# EAGLE design Escorna_CPU_2_20 (EAGLE 6.5.0)
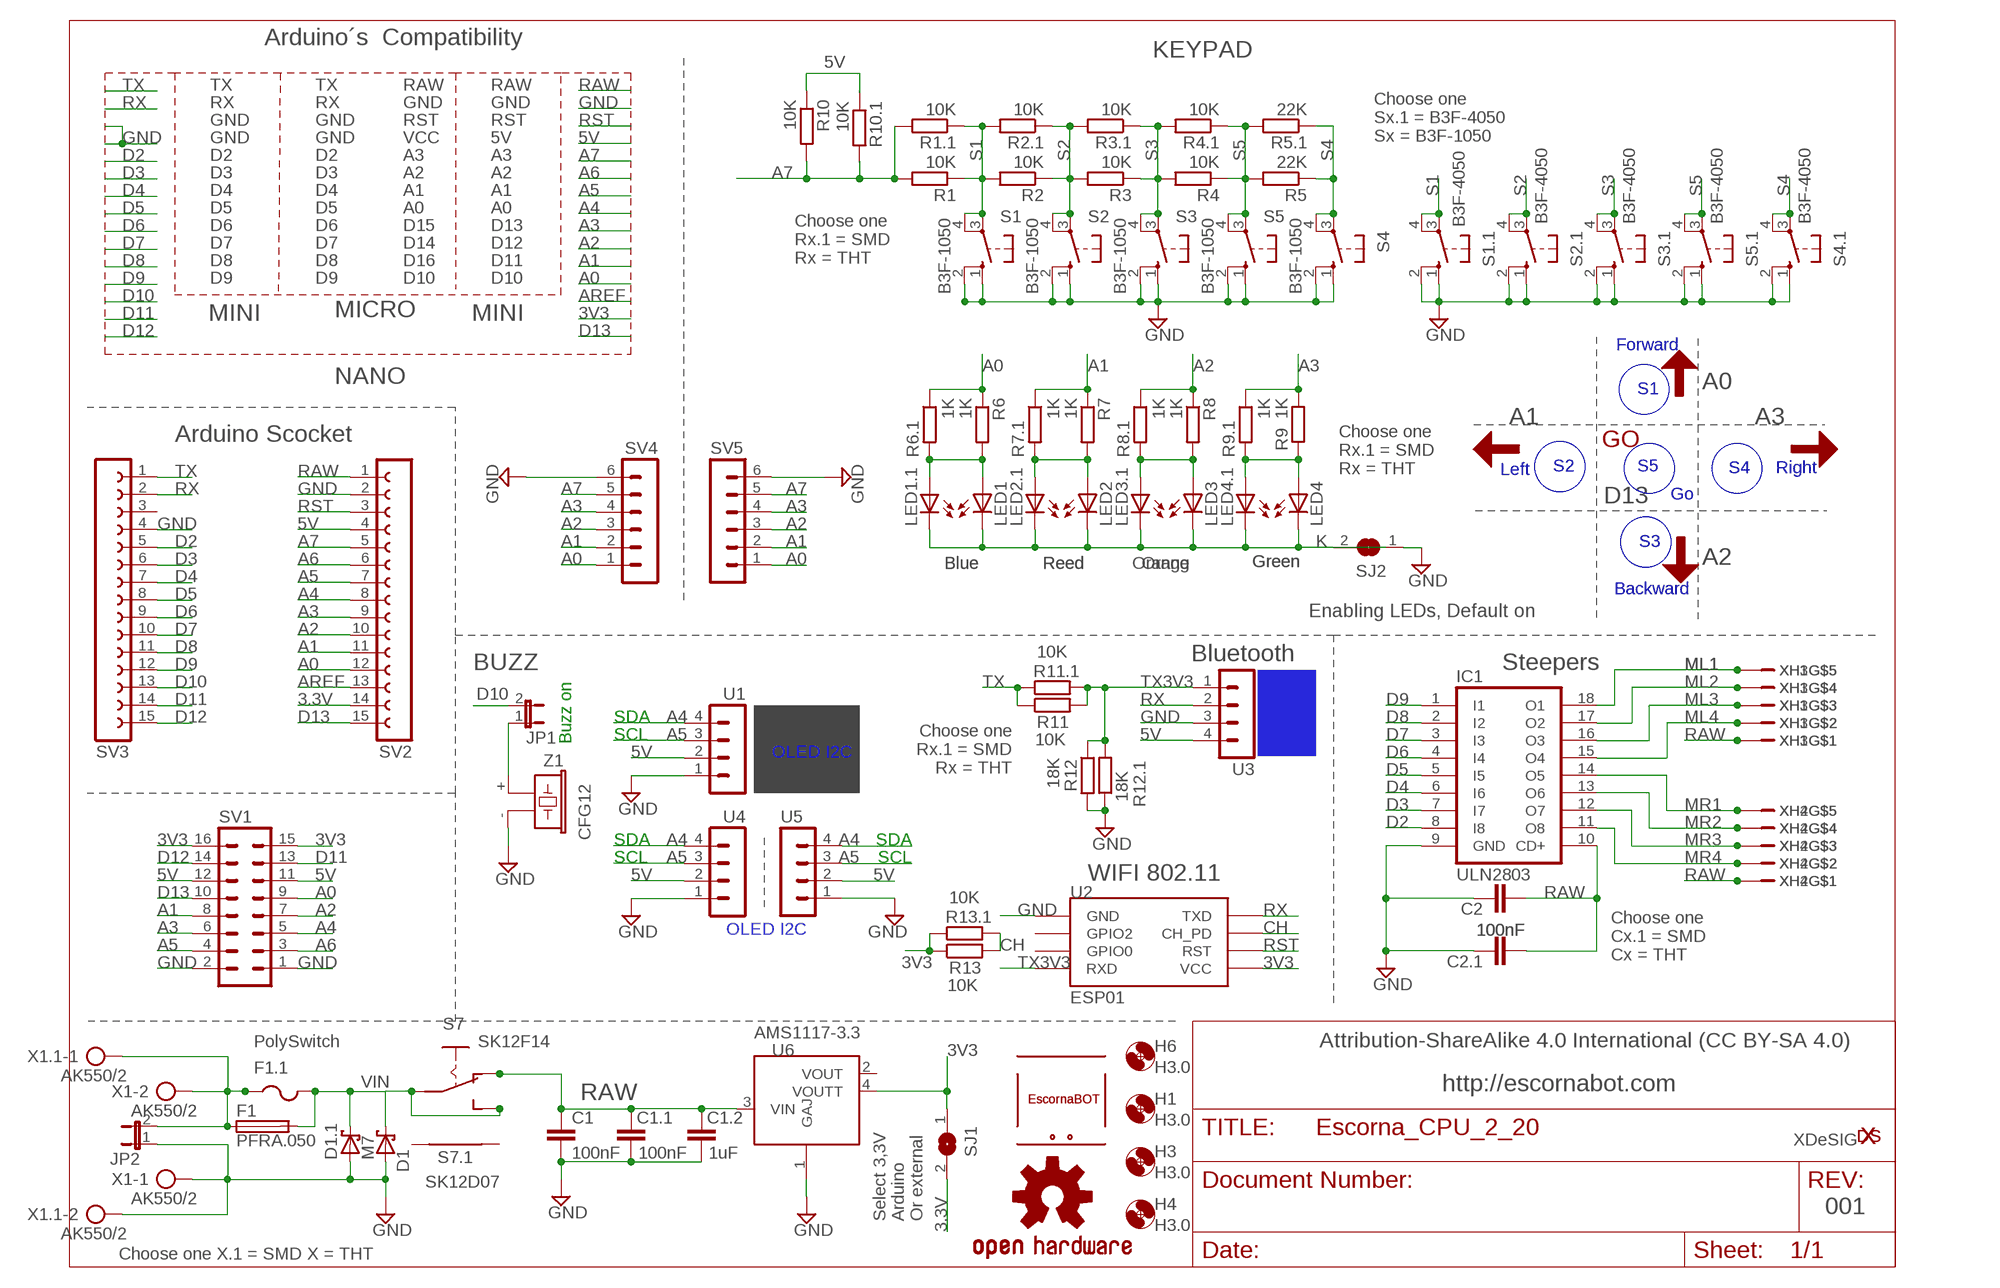
[diagram p0: schematic, sheet 1]

## Parts
C1  100nF  C-EU025-025X050  [C025-025X050]
C1.1  100nF  C-EUC0603K  [C0603K]
C1.2  1uF  C-EUC0603K  [C0603K]
C2  100nF  C-EU025-025X050  [C025-025X050]
C2.1  100nF  C-EUC0603K  [C0603K]
D1  1N5817  P4KEXX  [DO41-10]
D1.1  M7  SCHOTTKY-DIODESMA  [SMA]
ESC1  ESCORNABOT  [ESCORNA_PEQUE]
ESC2  ESCORNABOT  [ESCORNA_PEQUE]
F1  PFRA.050  FUSETE5  [TE5]
F1.1  PolySwitch  PTCFUSE-1206  [R1206]
H1  H3.0  MOUNT-HOLE3.0  [3,0]
H3  H3.0  MOUNT-HOLE3.0  [3,0]
H4  H3.0  MOUNT-HOLE3.0  [3,0]
H6  H3.0  MOUNT-HOLE3.0  [3,0]
IC1  ULN2803  ULN2803A  [DIL18]
JP1  JP1E  [1X02]
JP2  JP1E  [1X02]
LED1  Blue  LED3MM  [LED3MM]
LED1.1  Blue  LEDCHIPLED_0603  [CHIPLED_0603]
LED2  Reed  LED3MM  [LED3MM]
LED2.1  Reed  LEDCHIPLED_0603  [CHIPLED_0603]
LED3  Orange  LED3MM  [LED3MM]
LED3.1  Orang  LEDCHIPLED_0603  [CHIPLED_0603]
LED4  Green  LED3MM  [LED3MM]
LED4.1  Green  LEDCHIPLED_0603  [CHIPLED_0603]
LOGO2  OSHW-LOGOS  [OSHW-LOGO-S]
R1  10K  R-EU_0204/7  [0204/7]
R1.1  10K  R-EU_R0603  [R0603]
R2  10K  R-EU_0204/7  [0204/7]
R2.1  10K  R-EU_R0603  [R0603]
R3  10K  R-EU_0204/7  [0204/7]
R3.1  10K  R-EU_R0603  [R0603]
R4  10K  R-EU_0204/7  [0204/7]
R4.1  10K  R-EU_R0603  [R0603]
R5  22K  R-EU_0204/7  [0204/7]
R5.1  22K  R-EU_R0603  [R0603]
R6  1K  R-EU_0204/7  [0204/7]
R6.1  1K  R-EU_R0603  [R0603]
R7  1K  R-EU_0204/7  [0204/7]
R7.1  1K  R-EU_R0603  [R0603]
R8  1K  R-EU_0204/7  [0204/7]
R8.1  1K  R-EU_R0603  [R0603]
R9  1K  R-EU_0204/7  [0204/7]
R9.1  1K  R-EU_R0603  [R0603]
R10  10K  R-EU_0204/7  [0204/7]
R10.1  10K  R-EU_R0603  [R0603]
R11  10K  R-EU_0204/7  [0204/7]
R11.1  10K  R-EU_R0603  [R0603]
R12  18K  R-EU_0204/7  [0204/7]
R12.1  18K  R-EU_R0603  [R0603]
R13  10K  R-EU_0204/7  [0204/7]
R13.1  10K  R-EU_R0603  [R0603]
S1  B3F-1050  10-XX  [B3F-10XX]
S1.1  B3F-4050  40-XX  [B3F-40XX]
S2  B3F-1050  10-XX  [B3F-10XX]
S2.1  B3F-4050  40-XX  [B3F-40XX]
S3  B3F-1050  10-XX  [B3F-10XX]
S3.1  B3F-4050  40-XX  [B3F-40XX]
S4  B3F-1050  10-XX  [B3F-10XX]
S4.1  B3F-4050  40-XX  [B3F-40XX]
S5  B3F-1050  10-XX  [B3F-10XX]
S5.1  B3F-4050  40-XX  [B3F-40XX]
S7  SK12F14  ESCORNA_SK12F14F  [ESCORNA_SK-12F14-G]
S7.1  SK12D07  ESCORNA_SK12F14D  [ESCORNA_SK-12D07]
SJ1  SJ  [SJ]
SJ2  SJ  [SJ]
SV1  MA08-2  [MA08-2]
SV2  1x15 SOCKET STRIP  CON-LSTA_FE15-1  [CON-LSTA_FE15]
SV3  1x15 SOCKET STRIP  CON-LSTA_FE15-1  [CON-LSTA_FE15]
SV4  MA06-1  [MA06-1]
SV5  MA06-1  [MA06-1]
U1  MA04-1  [MA04-1]
U2  ESP01  [ESP01]
U3  MA04-1  [MA04-1]
U4  MA04-1  [MA04-1]
U5  MA04-1  [MA04-1]
U6  AMS1117-3.3  ASM1117-3.3  [SOT223]
U$1  FRECHA  [FRECHA]
U$2  GO  [VALE]
U$3  FRECHA  [FRECHA]
U$6  FRECHA  [FRECHA]
U$11  FRECHA  [FRECHA]
U$13  XDESIG_XDESIG21  [XDESIG_XDESIG]
X1  AK550/2  [AK550/2]
X1.1  AK550/2  [AK550/2]
XDS1  XDESIG  [XDESIG_CU_2]
XH1  B5B-XH-A  [B5B-XH-A]
XH2  B5B-XH-A  [B5B-XH-A]
XH3  B5B-XH-A  [B5B-XH-A]
XH4  B5B-XH-A  [B5B-XH-A]
Z1  CFG12  F/CM12P  [F/CM12P]

## Nets
3.3V: SJ1.2 SV2.14
3V3: R13.1 R13.1.1 SJ1.1 SV1.15 SV1.16 U2.VCC U6.4(VOUTT)
5V: R10.1 R10.1.1 SV1.11 SV1.12 SV2.4 U1.2 U3.4 U4.2 U5.2
A0: R6.1 R6.1.1 SV1.9 SV2.12 SV4.1 SV5.1
A1: R7.1 R7.1.1 SV1.8 SV2.11 SV4.2 SV5.2
A2: R8.1 R8.1.1 SV1.7 SV2.10 SV4.3 SV5.3
A3: R9.1.1 R9.2 SV1.6 SV2.9 SV4.4 SV5.4
A4: SV1.5 SV2.8 U1.4 U4.4 U5.4
A5: SV1.4 SV2.7 U1.3 U4.3 U5.3
A6: SV1.3 SV2.6
A7: R1.1.2 R1.2 R10.1.2 R10.2 SV2.5 SV4.5 SV5.5
AREF: SV2.13
CH: R13.1.2 R13.2 U2.CH_PD
D2: IC1.8(I8) SV3.5
D3: IC1.7(I7) SV3.6
D4: IC1.6(I6) SV3.7
D5: IC1.5(I5) SV3.8
D6: IC1.4(I4) SV3.9
D7: IC1.3(I3) SV3.10
D8: IC1.2(I2) SV3.11
D9: IC1.1(I1) SV3.12
D10: JP1.2 SV3.13
D11: SV1.13 SV3.14
D12: SV1.14 SV3.15
D13: SV1.10 SV2.15
GND: C1.1.1 C1.2 C1.2.1 C2.1 C2.1.1 D1.1.A D1.A IC1.9(GND) JP2.1 R12.1.1 R12.2 S1.1(S) S1.1.1(S) S1.1.2(S1) S1.2(S1) S2.1(S) S2.1.1(S) S2.1.2(S1) S2.2(S1) S3.1(S) S3.1.1(S) S3.1.2(S1) S3.2(S1) S4.1(S) S4.1.1(S) S4.1.2(S1) S4.2(S1) S5.1(S) S5.1.1(S) S5.1.2(S1) S5.2(S1) SJ2.1 SV1.1 SV1.2 SV2.2 SV3.4 SV4.6 SV5.6 U1.1 U2.GND U3.3 U4.1 U5.1 U6.1(GAJ) X1.1 X1.1.2 Z1.-
K: LED1.1.C LED1.K(C) LED2.1.C LED2.K(C) LED3.1.C LED3.K(C) LED4.1.C LED4.K(C) SJ2.2
ML1: IC1.18(O1) XH1.P$5 XH3.P$5
ML2: IC1.17(O2) XH1.P$4 XH3.P$4
ML3: IC1.16(O3) XH1.P$3 XH3.P$3
ML4: IC1.15(O4) XH1.P$2 XH3.P$2
MR1: IC1.14(O5) XH2.P$5 XH4.P$5
MR2: IC1.13(O6) XH2.P$4 XH4.P$4
MR3: IC1.12(O7) XH2.P$3 XH4.P$3
MR4: IC1.11(O8) XH2.P$2 XH4.P$2
N$2: JP1.1 Z1.+
N$3: F1.1 F1.1.1 JP2.2 X1.1.1 X1.2
N$4: LED2.1.A LED2.A R7.1.2 R7.2
N$5: LED1.1.A LED1.A R6.1.2 R6.2
N$6: LED3.1.A LED3.A R8.1.2 R8.2
N$8: LED4.1.A LED4.A R9.1 R9.1.2
N$10: S7.1.P$4 S7.P$4
N$11: S7.1.P$5 S7.P$5
RAW: C1.1 C1.1.2 C1.2.2 C2.1.2 C2.2 IC1.10(CD+) S7.1.P$2(O) S7.P$2(O) SV2.1 U6.3(VIN) XH1.P$1 XH2.P$1 XH3.P$1 XH4.P$1
RST: SV2.3 U2.RST
RX: SV3.2 U2.TX(TXD) U3.2
S1: R1.1 R1.1.1 R2.1.2 R2.2 S1.1.3(P) S1.1.4(P1) S1.3(P) S1.4(P1)
S2: R2.1 R2.1.1 R3.1.2 R3.2 S2.1.3(P) S2.1.4(P1) S2.3(P) S2.4(P1)
S3: R3.1 R3.1.1 R4.1.2 R4.2 S3.1.3(P) S3.1.4(P1) S3.3(P) S3.4(P1)
S4: R5.1 R5.1.1 S4.1.3(P) S4.1.4(P1) S4.3(P) S4.4(P1)
S5: R4.1 R4.1.1 R5.1.2 R5.2 S5.1.3(P) S5.1.4(P1) S5.3(P) S5.4(P1)
TX: R11.1 R11.1.1 SV3.1
TX3V3: R11.1.2 R11.2 R12.1 R12.1.2 U2.RX(RXD) U3.1
VIN: D1.1.C D1.C F1.1.2 F1.2 S7.1.P$1(P) S7.1.P$3(S) S7.P$1(P) S7.P$3(S)
Unconnected: SV3.3 U2.GPIO0 U2.GPIO2 U6.2(VOUT)

## Notes on the sheet
- Arduino´s  Compatibility
- KEYPAD
- TX | TX | RAW | RAW
- RX | RX | GND | GND
- GND | GND | RST | RST
- Choose one
  Sx.1 = B3F-4050
  Sx = B3F-1050
- GND | GND | VCC | 5V
- D2 | D2 | A3 | A3
- D3 | D3 | A2 | A2
- D4 | D4 | A1 | A1
- D5 | D5 | A0 | A0
- D6 | D6 | D15 | D13
- D7 | D7 | D14 | D12
- D8 | D8 | D16 | D11
- Choose one
  Rx.1 = SMD
  Rx = THT
- D9 | D9 | D10 | D10
- MINI | MINI
- MICRO
- Forward
- NANO | A0
- S1
- A1 | A3
- Arduino Scocket
- Left | S2 | S5 | S4 | Right
- Choose one
  Rx.1 = SMD
  Rx = THT
- D13 | Go
- S3
- A2
- Backward
- Enabling LEDs, Default on
- Bluetooth
- BUZZ | Steepers
- RXD
- TXD
- SDA
- Choose one
  Rx.1 = SMD
  Rx = THT
- GND
- Buzz on | SCL | VCC
- OLED I2C
- SDA | SDA
- SCL | SCL
- WIFI 802.11
- OLED I2C
- Choose one
  Cx.1 = SMD
  Cx = THT
- Attribution-ShareAlike 4.0 International (CC BY-SA 4.0)
- http://escornabot.com
- XDeSIG
- 001
- Select 3,3V
  Arduino
  Or external
- Choose one X.1 = SMD X = THT

## Library data of the parts
C1 C1.1 C1.2 C2 C2.1 = rcl:C-EU: CAPACITOR, European symbol
D1 = diode:P4KEXX: DIODE transient-voltage suppressor
D1.1 = diode:SCHOTTKY-DIODE: Schottky Diode
ESC1 ESC2 = escorna:ESCORNABOT
F1 = fuse:FUSE: Fuse; OC_FARNELL: unknown; OC_NEWARK: unknown
F1.1 = adafruit:PTCFUSE: PTC fuses, resettable thermistors
H1 H3 H4 H6 = holes:MOUNT-HOLE: MOUNTING HOLE with drill center marker
IC1 = uln-udn:ULN2803A: DRIVER ARRAY
JP1 JP2 = SparkFunEagle-6-6-07:JP1E: Jumper Basic 0.1" spaced jumper. Use with breakaway headers.
LED1 LED1.1 LED2 LED2.1 LED3 LED3.1 LED4 LED4.1 = led:LED: LED OSRAM: - CHIPLED LG R971, LG N971, LY N971, LG Q971, LY Q971, LO R971, LY R971 LH N974, LH R974 LS Q976, LO Q976, LY Q976 LO Q996 - Hyper CHIPLED LW Q18S LB Q993, LB Q99A, LB R99A - SideLED LS A670, LO A670, LY A670, LG A670, LP A670 LB A673, LV A673, LT A673, LW A673 LH A674 LY A675 LS A676, LA A676, LO A676, LY A676, LW A676 LS A679, LY A679, LG A679 - Hyper Micro SIDELED® LS Y876, LA Y876, LO Y876, LY Y876 LT Y87S - SmartLED LW L88C, LW L88S LB L89C, LB L89S, LG L890 LS L89K, LO L89K, LY L89K LS L896, LA L896, LO L896, LY L896 - TOPLED LS T670, LO T670, LY T670, LG T670, LP T670 LSG T670, LSP T670, LSY T670, LOP T670, LYG T670 LG T671, LOG T671, LSG T671 LB T673, LV T673, LT T673, LW T673 LH T674 LS T676, LA T676, LO T676, LY T676, LB T676, LH T676, LSB T676, LW T676 LB T67C, LV T67C, LT T67C, LS T67K, LO T67K, LY T67K, LW E67C LS E67B, LA E67B, LO E67B, LY E67B, LB E67C, LV E67C, LT E67C LW T67C LS T679, LY T679, LG T679 LS T770, LO T770, LY T770, LG T770, LP T770 LB T773, LV T773, LT T773, LW T773 LH T774 LS E675, LA E675, LY E675, LS T675 LS T776, LA T776, LO T776, LY T776, LB T776 LHGB T686 LT T68C, LB T68C - Hyper Mini TOPLED® LB M676 - Mini TOPLED Santana® LG M470 LS M47K, LO M47K, LY M47K Source: http://www.osram.convergy.de - LUMILED® LXK2-PW12-R00, LXK2-PW12-S00, LXK2-PW14-U00, LXK2-PW14-V00 LXK2-PM12-R00, LXK2-PM12-S00, LXK2-PM14-U00 LXK2-PE12-Q00, LXK2-PE12-R00, LXK2-PE12-S00, LXK2-PE14-T00, LXK2-PE14-U00 LXK2-PB12-K00, LXK2-PB12-L00, LXK2-PB12-M00, LXK2-PB14-N00, LXK2-PB14-P00, LXK2-PB14-Q00 LXK2-PR12-L00, LXK2-PR12-M00, LXK2-PR14-Q00, LXK2-PR14-R00 LXK2-PD12-Q00, LXK2-PD12-R00, LXK2-PD12-S00 LXK2-PH12-R00, LXK2-PH12-S00 LXK2-PL12-P00, LXK2-PL12-Q00, LXK2-PL12-R00 Source: www.luxeon.com
LOGO2 = SparkFun-Aesthetics:OSHW-LOGO: Open Source Hardware Logo This logo indicates the piece of hardware it is found on incorporates a OSHW license and/or adheres to the definition of open source hardware found here: http://freedomdefined.org/OSHW
R1 R1.1 R2 R2.1 R3 R3.1 R4 R4.1 R5 R5.1 R6 R6.1 R7 R7.1 R8 R8.1 R9 R9.1 R10 R10.1 R11 R11.1 R12 R12.1 R13 R13.1 = rcl:R-EU_: RESISTOR, European symbol
S1-S5 = switch-omron:10-XX: OMRON SWITCH; MPN: B3F-1000; OC_FARNELL: 176432; OC_NEWARK: 36M3542
S1.1 S2.1 S3.1 S4.1 S5.1 = switch-omron:40-XX: OMRON SWITCH; MF: OMRON COMPONENTS USA; MPN: B3F-4000; OC_FARNELL: 176434; OC_NEWARK: 36K3105
S7 S7.1 = escorna_ELIB:ESCORNA_SK12F14
SJ1 SJ2 = jumper:SJ: SMD solder JUMPER
SV1 = con-lstb:MA08-2: PIN HEADER; OC_FARNELL: unknown; OC_NEWARK: unknown
SV2 SV3 = escorna_LBREscorna_CPU_2_10:CON-LSTA_FE15-1: FEMALE HEADER; OC_FARNELL: unknown; OC_NEWARK: unknown
SV4 SV5 = con-lstb:MA06-1: PIN HEADER; OC_FARNELL: unknown; OC_NEWARK: unknown
U1 U3-U5 = con-lstb:MA04-1: PIN HEADER; OC_FARNELL: unknown; OC_NEWARK: unknown
U2 = esp8266modules:ESP01: ESP8266 Wifi module 01
U6 = Itead_IC_110429:ASM1117-3.3: ICP006
U$1 U$3 U$6 U$11 = escorna:FRECHA
U$2 = escorna:GO
U$13 = Escorna_CPU_2_01:XDESIG_XDESIG
X1 X1.1 = con-ptr500:AK550/2: CONNECTOR; OC_FARNELL: unknown; OC_NEWARK: unknown
XDS1 = xdesig:XDESIG
XH1-XH4 = con-jst:B5B-XH-A
Z1 = buzzer:F/CM12P: BUZZER Source: Buerklin; OC_FARNELL: unknown; OC_NEWARK: unknown

## Net classes
0 default: width 0.254 mm, drill 0.61 mm, clearance 0.254 mm
1 power: width 0.254 mm, drill 0.61 mm, clearance 0.254 mm

## Board
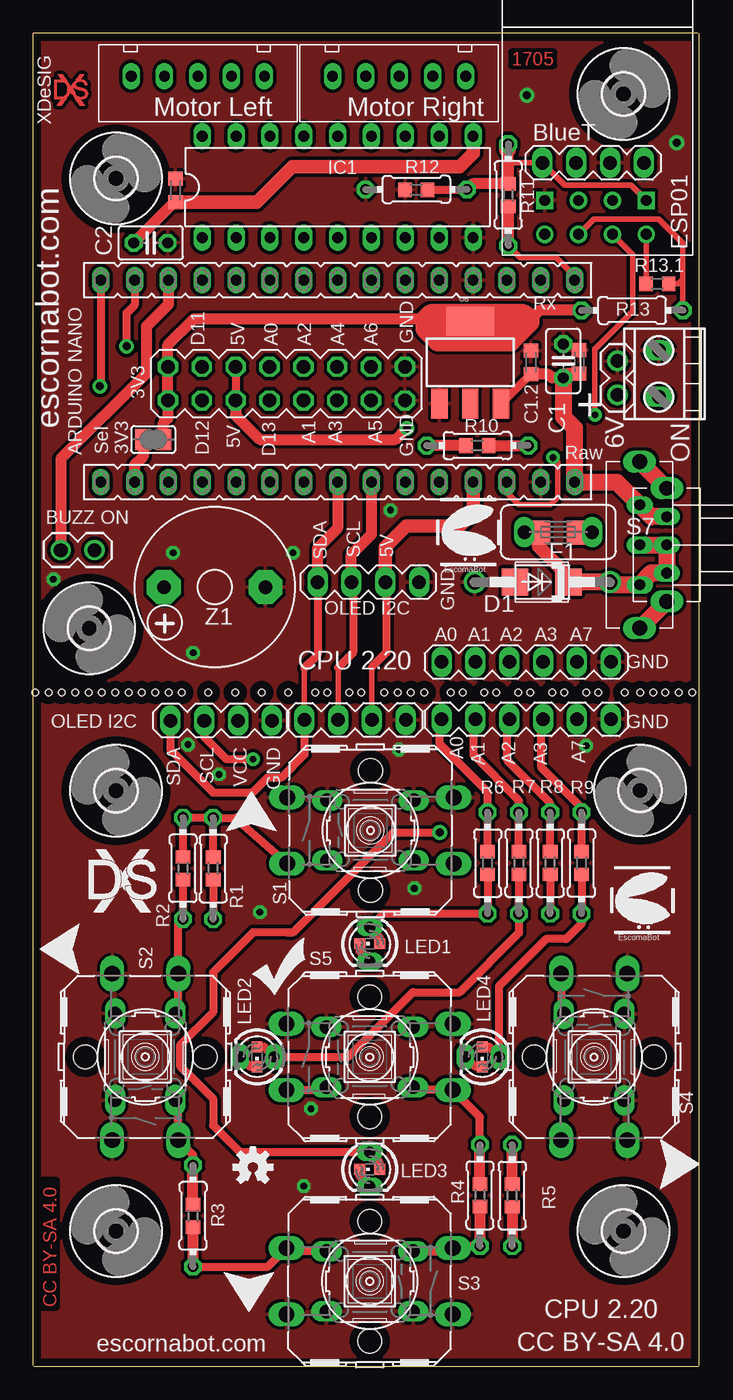
[diagram p1: board, top side]
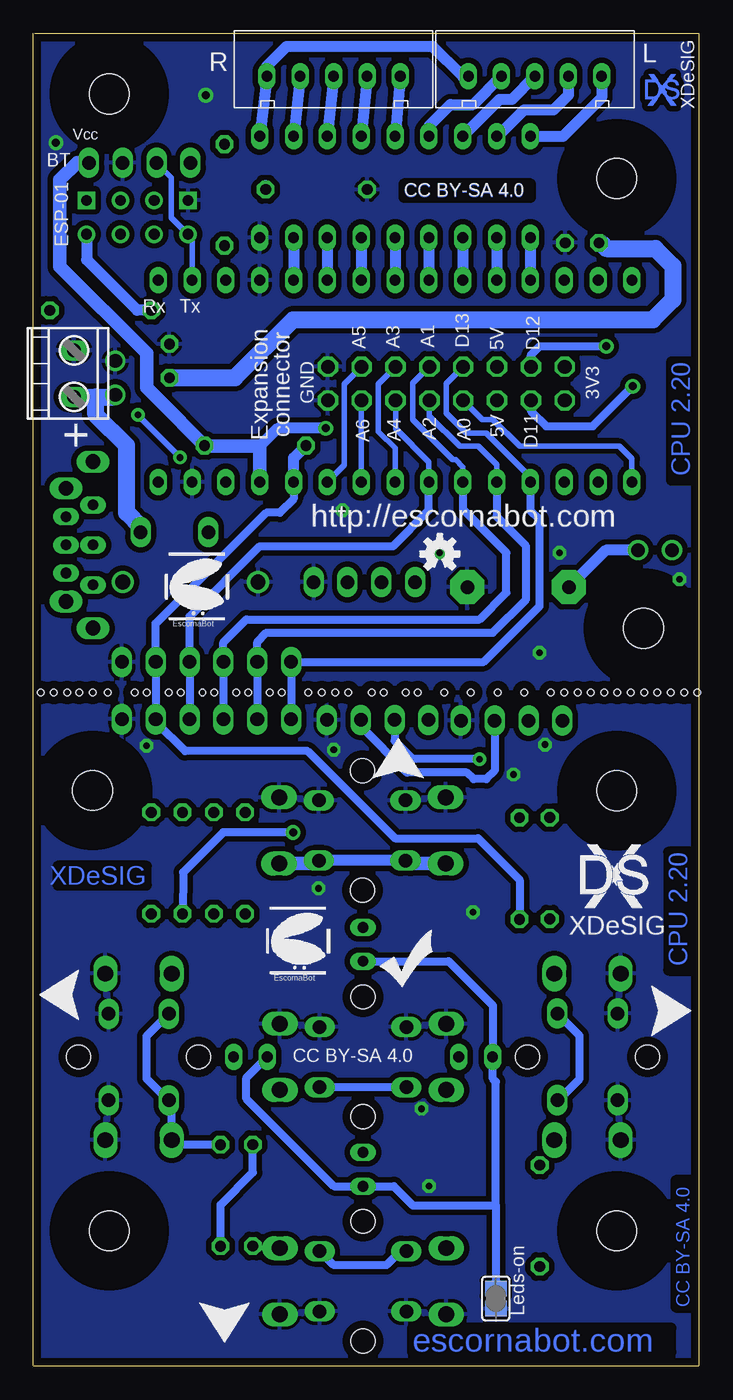
[diagram p2: board, bottom side, seen from below]

Size 50 x 100.09 mm. Coordinates in mm from the lower left corner, seen from the top.
Outline: 49.89,100.09 0,100.09
Outline: 0.05,0 49.95,0
Outline: 0,0.08 0,100.08
Outline: 50,0.08 50,100.08
Copper layers (1*16): Top 0.035mm / dielectric 1.5mm / Bottom 0.035mm
Design rules "default": minimum track width 10mil, minimum drill 22mil, track to track 10mil, track to pad 10mil, pad to pad 8mil, via to via 12mil, smd to smd 8mil, copper to edge 24mil, drill to drill 12mil, minimum pad ring 10mil, minimum via ring 10mil, stop-mask expansion 2mil, vias tented up to drill 30mil, thermal gap 10mil
Holes 0.5 mm at 31.35,50.58 32.25,50.58 33.85,50.58 34.75,50.58 23.7,50.58 24.6,50.58 21.15,50.58 22.05,50.58 36.4,50.58 37.3,50.58 38.95,50.58 39.85,50.58 41.5,50.58 42.4,50.58 44.4,50.58 46.55,50.58 47.45,50.58 49.45,50.58 19.15,50.58 17.15,50.58 15.15,50.58 13.15,50.58 10.15,50.58 9.15,50.58 8.15,50.58 7.15,50.58 6.15,50.58 5.15,50.58 4.15,50.58 3.15,50.58 2.15,50.58 1.15,50.58 28.35,50.58 29.35,50.58 27.35,50.58 26.35,50.58 48.45,50.58 11.15,50.58 45.55,50.58 0.15,50.58

### Footprints (pad centres in the part's own frame; a part is rotated, then mirrored left to right if it is on the bottom)
C025-025X050 = drill 0.813 octagon: 1 -1.27,0; 2 1.27,0
C0603K = smd 1.05 x 1.08: 1 -0.875,0; 2 0.875,0
DO41-10 = drill 1.118: A 5.08,0; C -5.08,0
SMA = smd 2 x 2: A 2,0; C -2,0
TE5 = drill 1.016 long: 1 -2.54,0; 2 2.54,0
R1206 = smd 1.6 x 1.803: 1 -1.422,0; 2 1.422,0
3,0 = hole 3: 0,0
DIL18 = drill 0.813 long: 1 -10.16,-3.81; 2 -7.62,-3.81; 3 -5.08,-3.81; 4 -2.54,-3.81; 5 0,-3.81; 6 2.54,-3.81; 7 5.08,-3.81; 8 7.62,-3.81; 9 10.16,-3.81; 10 10.16,3.81; 11 7.62,3.81; 12 5.08,3.81; 13 2.54,3.81; 14 0,3.81; 15 -2.54,3.81; 16 -5.08,3.81; 17 -7.62,3.81; 18 -10.16,3.81
1X02 = drill 1.016: 1 0,0; 2 2.54,0
LED3MM = drill 0.813 pad 1.016 long: A -1.27,0; K 1.27,0
CHIPLED_0603 = smd 0.8 x 0.8: A 0,-0.75; C 0,0.75
0204/7 = drill 0.813 octagon: 1 -3.81,0; 2 3.81,0
R0603 = smd 1 x 1.1: 1 -0.85,0; 2 0.85,0
B3F-10XX = drill 1.016 long: 1 -3.251,2.261; 2 3.251,2.261; 3 -3.251,-2.261; 4 3.251,-2.261
B3F-40XX = drill 1.194 long: 1 -6.248,2.489; 2 6.248,2.489; 3 -6.248,-2.489; 4 6.248,-2.489 | hole 1.803: 0,-4.496; 0,4.496
ESCORNA_SK-12F14-G = drill 0.8 long: P$1 0,0; P$2 3,0; P$3 -3,0 | drill 1.1 long: P$4 -6.25,0; P$5 6.25,0
ESCORNA_SK-12D07 = drill 0.8 long: P$1 0,0; P$2 2.115,0; P$3 -2.115,0 | drill 1.1 pad 1.27 long: P$4 -4.25,0; P$5 4.25,0
SJ = smd 1.168 x 1.6: 1 -0.762,0; 2 0.762,0
MA08-2 = drill 1.016 octagon: 1 -8.89,-1.27; 2 -8.89,1.27; 3 -6.35,-1.27; 4 -6.35,1.27; 5 -3.81,-1.27; 6 -3.81,1.27; 7 -1.27,-1.27; 8 -1.27,1.27; 9 1.27,-1.27; 10 1.27,1.27; 11 3.81,-1.27; 12 3.81,1.27; 13 6.35,-1.27; 14 6.35,1.27; 15 8.89,-1.27; 16 8.89,1.27
CON-LSTA_FE15 = drill 0.813 long: 1 -17.78,0; 2 -15.24,0; 3 -12.7,0; 4 -10.16,0; 5 -7.62,0; 6 -5.08,0; 7 -2.54,0; 8 0,0; 9 2.54,0; 10 5.08,0; 11 7.62,0; 12 10.16,0; 13 12.7,0; 14 15.24,0; 15 17.78,0
MA06-1 = drill 1.016 long: 1 -6.35,0; 2 -3.81,0; 3 -1.27,0; 4 1.27,0; 5 3.81,0; 6 6.35,0
MA04-1 = drill 1.016 long: 1 -3.81,0; 2 -1.27,0; 3 1.27,0; 4 3.81,0
ESP01 = drill 0.8: CH_PD -1.285,-8.178; GPIO0 1.255,-5.638; GPIO2 -1.285,-5.638; RST 1.255,-8.178; TX -3.825,-8.178; VCC 3.795,-8.178 | drill 0.8 square: GND -3.825,-5.638; RX 3.795,-5.638
SOT223 = smd 1.219 x 2.235: 1 -2.311,-3.099; 2 0,-3.099; 3 2.311,-3.099 | smd 3.6 x 2.2: 4 0,3.099
AK550/2 = drill 1 pad 1.5 long: 1 -1.75,0; 2 1.75,0
B5B-XH-A = drill 0.8 long: P$1 -5.17,-0.19; P$2 -2.69,-0.175; P$3 -0.175,-0.175; P$4 2.34,-0.175; P$5 4.83,-0.175
F/CM12P = drill 1.016 pad 2.54 octagon: + 3.81,0; - -3.81,0

### Placement (x,y rotation side)
C1  39.78,75.48 90 top
C1.1  40.97,75.42 270 top
C1.2  37.35,75.38 270 top
C2  8.81,84.35 180 top
C2.1  10.67,88.29 270 top
D1  38.21,58.88 180 top
D1.1  38.16,58.88 180 top
ESC  ESCORNABOT  [ESCORNA_PEQUE]  32.6,29.36 0 bottom
ESC1  40.2,55.96 0 bottom
ESC2  30.2,60.03 0 top
F1  39.4,62.63 180 top
F1.1  39.41,62.61 180 top
H1  44.3,10.16 90 top
H2  MOUNT-HOLE3.0  [3,0]  6.2,10.16 90 top
H3  44.3,95.53 0 top
H4  6.2,89.18 0 top
H5  MOUNT-HOLE3.0  [3,0]  6.2,43.21 90 top
H6  45.55,43.23 0 top
H7  MOUNT-HOLE3.0  [3,0]  4.2,55.41 90 top
IC1  22.84,88.54 0 top
JP1  4.6,61.28 180 top
JP2  43.85,75.48 270 top
LED1  25.25,31.68 270 top
LED1.1  25.25,31.73 90 top
LED2  16.8,23.23 180 top
LED2.1  16.8,23.23 180 top
LED3  25.25,14.78 270 top
LED3.1  25.25,14.78 90 top
LED4  33.7,23.23 180 top
LED4.1  33.7,23.23 180 top
LOGO1  OSHW-LOGOS  [OSHW-LOGO-S]  16.48,14.94 0 top
LOGO2  19.48,60.99 0 bottom
R1  13.5,37.37 270 top
R1.1  13.5,37.37 270 top
R2  11.24,37.39 90 top
R2.1  11.24,37.39 90 top
R3  11.99,11.29 90 top
R3.1  11.99,11.29 90 top
R4  33.52,12.83 270 top
R4.1  33.52,12.83 270 top
R5  35.95,12.82 270 top
R5.1  35.95,12.82 270 top
R6  34.1,37.78 270 top
R6.1  34.1,37.78 270 top
R7  36.45,37.78 270 top
R7.1  36.45,37.78 270 top
R8  38.8,37.78 270 top
R8.1  38.8,37.78 270 top
R9  41.15,37.78 90 top
R9.1  41.15,37.78 270 top
R10  33.34,69.13 180 top
R10.1  33.34,69.13 180 top
R11  35.65,87.95 90 top
R11.1  35.65,87.93 90 top
R12  28.75,88.36 180 top
R12.1  28.75,88.33 0 top
R13  44.95,79.28 0 top
R13.1  46.85,81.28 0 top
S1  25.31,40.23 0 top
S1.1  25.3,40.23 0 top
S2  8.41,23.23 90 top
S2.1  8.4,23.23 90 top
S3  25.25,6.38 180 top
S3.1  25.25,6.38 180 top
S4  42.09,23.21 270 top
S4.1  42.1,23.23 270 top
S5  25.25,23.21 0 top
S5.1  25.25,23.23 0 top
S7  45.52,61.67 90 top
S7.1  47.55,61.67 90 top
SJ1  9,69.58 180 top
SJ2  15.28,5.08 90 bottom
SV1  19,73.78 180 top
SV2  22.84,66.38 180 top
SV3  22.84,81.56 180 top
SV4  37,52.88 0 top
SV5  37,48.58 0 top
U1  25.15,58.88 180 top
U2  42.21,93.18 0 top
U3  42.02,90.36 0 top
U4  24.15,48.53 180 top
U5  14.1,48.48 180 top
U6  32.8,75.38 0 top
U$1  46.54,29.81 180 bottom
U$2  24.03,28.43 0 bottom
U$3  3.64,24.76 0 bottom
U$4  FRECHA  [FRECHA]  14.26,7.09 270 top
U$5  ESCORNABOT  [ESCORNA_PEQUE]  43.25,32.4 0 top
U$6  37.57,4.79 270 bottom
U$7  FRECHA  [FRECHA]  47.01,13.25 0 top
U$8  FRECHA  [FRECHA]  18.29,40.16 90 top
U$9  FRECHA  [FRECHA]  3.49,33.25 180 top
U$10  GO  [VALE]  16.4,27.85 0 top
U$11  20.67,44.14 90 bottom
U$12  XDESIG_XDESIG21  [XDESIG_XDESIG]  4.18,34.07 0 top
U$13  8.93,34.42 0 bottom
X1  46.96,74.54 270 bottom
X1.1  46.94,74.52 90 top
XDS  XDESIG  [XDESIG_CU_2]  1.57,94.64 0 top
XDS1  4.05,94.64 0 bottom
XH1  12.18,97.05 0 bottom
XH2  27.29,97.05 0 bottom
XH3  12.18,96.67 180 top
XH4  27.29,96.67 180 top
Z1  13.61,58.5 180 top

### Tracks (layer width: path | path; a pad name or v marks a point on that pad's centre or on a via)
3.3V
  Top 0.813: SJ1.2 8.24,68.32 7.6,67.69 SV2.14
3V3
  Top 0.406: R13.1.1 U2.VCC
  Top 0.61: 37.4,78.48 37.3,78.58
  Top 0.813: SJ1.1 9.76,70.84 10.11,71.19 SV1.16 SV1.15 10.11,76.69 12.05,78.63 29.4,78.63 | R13.1 38,79.28 37.3,78.58
  Top 1.422: U6.4 31.5,78.48 31.1,78.88 29.65,78.88 | 29.65,78.88 29.45,78.68 | 29.45,78.68 29.4,78.63 29.4,77.88 30.35,76.93 35.85,76.93 37.3,78.38 37.3,78.58 36.85,79.03 29.8,79.03 29.65,78.88 | 29.45,78.68 29.8,78.68 30.6,77.88 35.45,77.88 35.9,78.33
  Bottom 0.813: R13.1 42.2,79.28 46.01,83.09 U2.VCC
5V  (via drill 0.6)
  Top 0.406: U4.2 25.42,52.5
  Top 0.61: U1.2 26.5,58.8 26.5,53.58 25.42,52.5 | SV1.11 SV1.12
  Top 0.813: R10.1.1 R10.1 | SV1.12 15.19,71.39 17,69.58 27.2,69.58 v28.05,70.43
  Top 1.016: SV2.4 33.01,64.08 32,63.08 28,63.08 26.42,61.5 U1.2
  Bottom 0.61: U5.2 15.37,44.71 16,44.08 16.95,44.08 17.45,44.58 21.95,44.58 25.5,48.13 25.5,48.45 U4.2
  Bottom 0.813: 35,69.08 37.1,69.08 | v28.05,70.43 31.65,70.43 33.01,69.08
  Bottom 1.016: U3.4 46.72,90.36 48,89.08 48,82.58 41.5,76.08 41.5,73.48 40.6,72.58 R10.1 37.1,69.08 33,69.08 33.01,69.08 SV2.4
A0
  Top 0.61: R6.1.1 R6.1 34.1,43.13 30.51,46.72 30.51,48.44 SV5.1
  Bottom 0.406: SV2.12 12.68,66.76 16,70.08 17.5,70.08 19,71.58 19,73.78 SV1.9 | 16.3,52.78 12,57.08
  Bottom 0.61: SV2.12 12.68,64.26 12,63.58 12,57.08 16.2,52.88 SV4.1 SV5.1
A1
  Top 0.61: R7.1.1 R7.1 36.45,42.48 33.05,45.88 33.05,48.44 SV5.2
  Bottom 0.406: SV2.11 15.22,67.7 16.6,69.08 18,69.08 20.27,71.35 SV1.8
  Bottom 0.61: SV2.11 15.22,63.8 13,61.58 13,57.58 15.5,55.08 32.5,55.08 33.19,54.39 SV4.2 SV5.2
A2
  Top 0.61: R8.1.1 R8.1 38.8,42.28 35.59,45.49 35.59,48.44 SV5.3
  Bottom 0.406: SV2.10 17.75,66.39 17.75,67.53 18.3,68.08 18.5,68.08 21.5,71.08 21.5,73.82 SV1.7 | 32,56.08 16.5,56.08
  Bottom 0.61: SV2.10 17.77,64.34 14.5,61.08 14.5,58.08 16.5,56.08 34,56.08 35.73,54.35 SV4.3 SV5.3
A3
  Top 0.61: R9.1.1 R9.2 41.15,41.93 38.13,44.95 38.13,48.44 SV5.4
  Bottom 0.406: SV1.6 22.81,70.39 20.3,67.89 SV2.9
  Bottom 0.61: SV2.9 20.3,64.27 23,61.58 33,61.58 38.27,56.31 SV4.4 SV5.4
A4
  Top 0.406: 20.34,52.42 U4.4
  Top 0.61: U5.4 10.29,46.29 13.5,43.08 16.46,43.08 17.55,44.17 18.59,44.17 20.34,45.92 U4.4 20.34,47.42 | U1.4 21.34,53.42 20.34,52.42
  Top 0.813: U1.4 21.34,61.42 22.84,62.92 SV2.8
  Bottom 0.406: 22.84,66.92 SV2.8 22.84,68.92 24.1,70.18 24.1,73.76 SV1.5
A5  (via drill 0.5)
  Top 0.406: U4.3 22.88,52.46
  Top 0.61: U1.3 24,58.76 24,53.58 22.88,52.46 | U5.3 12.83,47.25 14.5,45.58 v16.5,45.58
  Top 0.813: SV2.7 25.38,62.46 23.88,60.96 U1.3
  Bottom 0.406: 25.38,66.97 SV2.7 25.38,72.47 SV1.4
  Bottom 0.61: v16.5,45.58 21.5,45.58 22.88,46.96 U4.3
A6
  Bottom 0.406: SV1.3 26.65,73.75 26.65,67.66 SV2.6
A7
  Top 0.61: R1.1.2 R1.2
  Top 0.813: R10.1.2 R10.2
  Bottom 0.61: R1.2 R1.1.2 16.61,39.63 22.85,39.63 29.4,46.18 38.6,46.18 40.81,48.39 SV5.5 SV4.5 40.81,55.77 32.5,64.08 31.5,64.08 30.46,65.11 SV2.5
  Bottom 0.813: SV2.5 30.46,68.19 R10.2
CH
  Top 0.406: R13.2 48.76,81.58 | 48.76,81.58 48.76,84.32 46.95,86.13 42.06,86.13 U2.CH_PD | R13.1.2 48.46,81.28 48.76,81.58
D2
  Bottom 0.813: IC1.8 SV3.5
D3
  Bottom 0.813: IC1.7 SV3.6
D4
  Bottom 0.813: IC1.6 SV3.7 25.38,81.19 25.5,81.08
D5
  Bottom 0.813: IC1.5 SV3.8
D6
  Bottom 0.813: IC1.4 SV3.9
D7
  Bottom 0.813: IC1.3 SV3.10
D8
  Bottom 0.813: IC1.2 SV3.11
D9
  Bottom 0.813: IC1.1 SV3.12
D10
  Top 0.813: SV3.13 10.14,79.72 8.5,78.08 8.5,74.58 2.06,68.14 JP1.2
D11  (via drill 0.6)
  Top 0.61: v7,76.58 7,79.08 7.6,79.69 SV3.14
  Bottom 0.61: SV1.13 12.65,75.93 12,76.58 v7,76.58
D12  (via drill 0.6)
  Top 0.61: SV3.15 5.06,73.64 v5,73.58
  Bottom 0.61: SV1.14 12.65,71.73 11.5,70.58 8,70.58 5.25,73.33 v5,73.58
D13
  Bottom 0.406: SV2.15 5.06,68.14 6,69.08 13.5,69.08 15.5,71.08 16.3,71.08 SV1.10
GND  (via drill 0.5, 0.6)
  other vias: 48.3,91.88 37.05,95.43 11.6,46.68 19.5,61.08 12,53.58 10.5,61.08 1.5,59.08 17,34.08 20.85,19.33 13.95,44.43 20.3,13.53 41.5,46.58 27.45,46.28 28.6,35.88 26.8,64.28
  pour Bottom (isolate 0.406): 0.5,102.58 50.5,102.58 50,-0.42 0,-0.42
  pour Top: -0.4,102.93 50.6,102.93 50.5,-1.42 -0.5,-1.42
K
  Top 0.61: LED4.1.C 33.18,22.48 LED4.K | LED1.1.C 24.5,31.16 LED1.K | LED3.1.C 24.5,14.26 LED3.K | LED2.1.C 16.28,22.48 LED2.K
  Bottom 0.61: LED1.K 18.83,30.41 15.5,27.08 15.5,23.26 LED2.K 15.5,23.2 15.5,21.58 15.28,21.36 15.28,12.08 | LED4.K 34,21.66 34,20.08 27.43,13.51 LED3.K 22.93,13.51 21.5,12.08 15.28,12.08 | 15.28,12.08 SJ2.2
ML1
  Bottom 0.813: IC1.18 10.23,92.35 7.35,95.23 XH3.P$5 XH1.P$5
ML2
  Bottom 0.813: XH1.P$4 XH3.P$4 9.84,95.44 10.95,94.33 13.15,94.33 15.13,92.35 IC1.17
ML3
  Bottom 0.813: XH1.P$3 XH3.P$3 14.07,95.13 15,95.13 17.77,92.36 IC1.16
ML4
  Bottom 0.813: XH1.P$2 XH3.P$2 16.98,94.73 18.7,94.73 20.3,93.13 IC1.15
MR1
  Bottom 0.813: IC1.14 XH2.P$5 XH4.P$5
MR2
  Bottom 0.813: IC1.13 XH4.P$4 XH2.P$4
MR3
  Bottom 0.813: IC1.12 XH2.P$3 XH4.P$3
MR4
  Bottom 0.813: IC1.11 XH4.P$2 XH2.P$2
N$2
  Bottom 0.813: JP1.1 7.02,61.28 Z1.+
N$3  (1 unrouted)
  Top 1.016: F1.1.1 41.92,62.61 F1.1
  Bottom 1.016: X1.1.1 X1.2
  Bottom 1.27: F1.1 41.94,63.02 43,64.08 43,69.13 45.3,71.43 45.3,72.72 45.35,72.77 | X1.1.1 45.35,72.77 | 45.35,72.77 44.02,72.77 JP2.2
N$4
  Top 0.61: R7.1.2 R7.2 | R7.2 36.45,35.03 | R7.2 36.45,32.53 32,28.08 28.5,28.08 23.65,23.23 LED2.A 17.32,23.98 LED2.1.A
N$5
  Top 0.61: R6.1.2 R6.2 26.27,33.97 LED1.A 26,32.2 LED1.1.A
N$6  (via drill 0.6)
  Top 0.61: R8.1.2 R8.2 | v30.5,40.08 27,40.08 19.5,32.58 | 19,32.58 19.5,32.58 | LED3.1.A 26,15.3 LED3.A 25.22,16.08 15.5,16.08 13.5,18.08 13.5,20.08 12.17,21.41 12.14,21.41 11,22.56 11,24.08 13.5,26.58 13.5,29.58 16.5,32.58 19.5,32.58
  Bottom 0.61: v30.5,40.08 35.75,40.08 38.75,37.08 R8.2
N$8
  Top 0.61: R9.1.2 R9.1 | R9.1 41.1,33.92 | R9.1 41.15,33.23 40,32.08 38.5,32.08 34.97,28.55 LED4.A 34.22,23.98 LED4.1.A
N$9
  Bottom 0.406: 15,6.08 15.25,6.08 15.25,4.08
N$10
  Top 1.27: S7.P$4 45.55,55.42 S7.1.P$4
N$11
  Top 1.27: S7.1.P$5 47.52,65.92 S7.P$5
RAW
  Top 0.61: 35.08,72.25 U6.3 35.13,72.28 C1.2.2
  Top 0.813: C2.1.2 10.37,87.18 C2.2 | C1.2.2 37.38,74.48 38.65,74.48 38.92,74.22 C1.1 40.12,74.55 C1.1.2
  Top 1.016: C2.1.2 16.79,87.41 19.45,90.08 32,90.08 33.01,91.08 IC1.10
  Top 1.27: C1.1 39.78,71.3 40.62,70.46 SV2.1 43.81,66.38 S7.P$2 46.4,63.79 S7.1.P$2
  Bottom 0.813: 32.55,96.09 XH4.P$1 | 32.55,96.09 IC1.10 | 32.55,96.09 32.5,96.14 32.5,97.58 31,99.08 20,99.08 17.78,96.86 XH3.P$1
  Bottom 1.27: C1.1 34.87,74.22 30.5,78.58 3.5,78.58 2,80.08 2,82.62 3.31,83.93 7,83.93 7.42,84.35 C2.2
RST  (via drill 0.5)
  Top 0.406: SV2.3 35.54,65.58 36.45,64.68 38.8,64.68 39.35,65.23 39.35,67.93 39,68.28 v39,68.23 | v42.15,71.43 42.15,76.38 45,79.23 45,83.47 U2.RST
  Bottom 0.406: v39,68.23 39,68.28 v42.15,71.43
RX
  Bottom 0.406: 38.08,82.19 SV3.2 38.08,84.7 U2.TX 38.42,85 39.65,86.23 39.65,89.26 U3.2
S1
  Top 0.61: R2.1.2 R2.2 13.98,41.2 R1.1 | R1.1 15.16,41.18 S1.1.3 | R1.1.1 R1.1
  Bottom 0.813: S1.3 S1.4
  Bottom 1.016: S1.1.3 21.83,37.74 S1.3 | S1.1.4 28.79,37.74 S1.4
S2
  Top 0.61: R2.1.1 R2.1 10.89,33.23 S2.1.4 10.89,26.7 S2.4 | R3.2 11.99,15.88 S2.1.3 10.89,19.76 S2.3
  Top 0.813: R3.1.2 R3.2
  Bottom 0.61: S2.3 10.6,19.98 9,21.58 9,24.81 S2.4
  Bottom 0.813: 12.04,15.15 R3.2 | S2.4 10.67,26.25
S3
  Top 0.61: S3.3 31.27,8.64 S3.1.3 31.65,9.02 R4.2 | S3.4 19.23,8.64 S3.1.4 17.61,7.48 R3.1
  Top 0.813: R3.1.1 R3.1 12.1,7.48 | R4.1.2 R4.2
  Bottom 0.61: S3.4 22.44,8.64 23.5,7.58 27.45,7.58 S3.3
S4
  Top 0.61: 39.61,19.75 S4.4 | S4.1.3 39.61,26.68 S4.3
  Top 0.813: R5.1.1 R5.1
  Bottom 0.61: R5.1 39.26,16.63 S4.1.4 39.61,19.75 S4.4 39.88,19.96 41.5,21.58 41.5,24.79 S4.3
S5
  Top 0.61: R4.1 33.52,18.71 S5.1.4 28.71,20.74 S5.4 | S5.1.3 21.79,20.74 S5.3
  Top 0.813: R4.1.1 R4.1 | R5.1.2 R5.2
  Bottom 0.61: 22.37,20.95 S5.3 S5.4 | R4.1 33.52,14.56 35.95,12.13 R5.2
TX
  Top 0.406: SV3.1 40.62,81.86 39.25,83.23 36.56,83.23 R11.1
  Top 0.813: R11.1.1 R11.1
TX3V3
  Top 0.406: U2.RX 46.01,87.57 44.9,88.68 39.89,88.68 U3.1 35.93,90.36 35.65,90.08
  Top 0.61: R12.1.2 32.53,88.33 R12.1
  Top 0.813: R11.2 35.65,90.08 R11.1.2 32.98,88.78 R12.1
  Top 1.27: 35.6,91.37 R11.2
  Bottom 0.813: R12.1 32.56,88.65
VIN
  Top 0.813: D1.1.C 40,58.88
  Top 1.016: 40,58.88 40,59.48 37.95,61.53 37.95,62.57 F1.1.2 36.88,62.61 F1.2
  Top 1.27: D1.1.C D1.C 43.5,58.67 S7.P$3 46.4,59.56 S7.1.P$3 S7.1.P$1 S7.P$1

### Text on the board
Top: 1705 | CC BY-SA 4.0
Bottom: CC BY-SA 4.0 | CPU 2.20 | CPU 2.20 | XDeSIG | CC BY-SA 4.0 | escornabot.com
tPlace: Motor Left | Motor Right | XDeSIG | BlueT | ESP01 | escornabot.com | ARDUINO NANO | Rx | D11 | 5V | A0 | A2 | A4 | A6 | GND | 3V3 | D12 | 5V | D13 | A1 | A3 | A5 | + | ON | Raw | 6V | Sel / 3V3 | GND | BUZZ ON | SDA | SCL | 5V | GND | OLED I2C | A0 | A1 | A2 | A3 | A7 | CPU 2.20 | GND | GND | OLED I2C | A0 | A1 | A2 | A3 | A7 | SDA | SCL | VCC | GND | CPU 2.20 | escornabot.com | CC BY-SA 4.0
bPlace: XDeSIG | R | L | Vcc | BT | CC BY-SA 4.0 | ESP-01 | Tx | Rx | connector | Expansion | D12 | 5V | D13 | A1 | A3 | A5 | 3V3 | GND | 5V | A0 | A2 | A4 | A6 | D11 | + | http://escornabot.com | XDeSIG | CC BY-SA 4.0 | Leds-on
Measures: Attribution-ShareAlike 4.0 International (CC BY-SA 4.0)
tDocu: Attribution-ShareAlike 4.0 International (CC BY-SA 4.0)